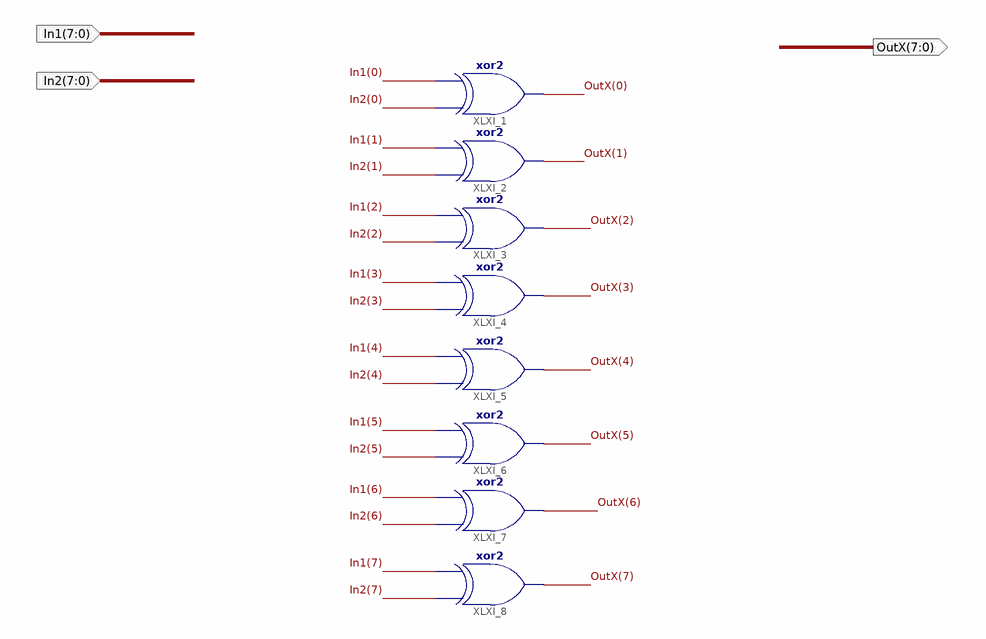
[diagram p0: schematic sheet 1]
// Xilinx ISE schematic Xor.sch (spartan6) as structural Verilog: 8 symbols, 3 ports
module Xor (
  input  [7:0] In1,
  input  [7:0] In2,
  output [7:0] OutX
);

  xor XLXI_1 (OutX[0], In2[0], In1[0]);
  xor XLXI_2 (OutX[1], In2[1], In1[1]);
  xor XLXI_3 (OutX[2], In2[2], In1[2]);
  xor XLXI_4 (OutX[3], In2[3], In1[3]);
  xor XLXI_5 (OutX[4], In2[4], In1[4]);
  xor XLXI_6 (OutX[5], In2[5], In1[5]);
  xor XLXI_7 (OutX[6], In2[6], In1[6]);
  xor XLXI_8 (OutX[7], In2[7], In1[7]);
endmodule
